# EAGLE design laserControlerArduinoShield (EAGLE 9.6.2)
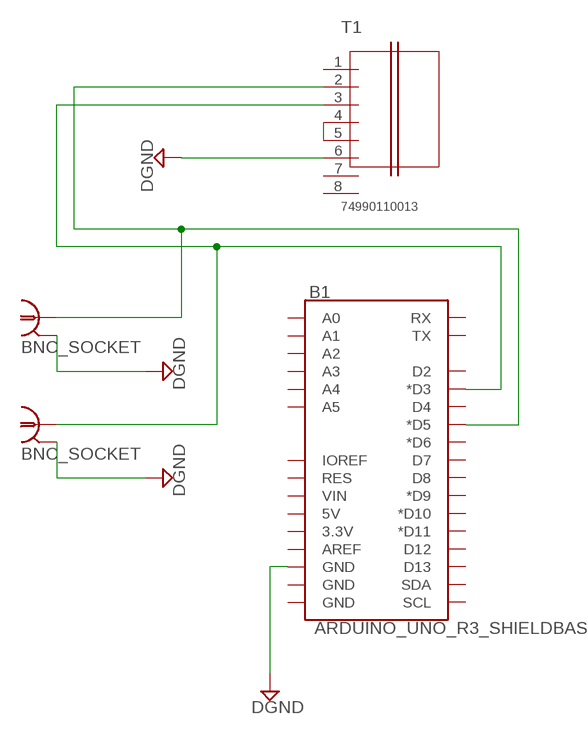
[diagram p0: schematic, sheet 1]

## Parts
B1  ARDUINO_UNO_R3_SHIELDBASIC  [UNO_R3_SHIELD]
BNC_POWER  BNC_SOCKET  [BNC_SOCKET]
BNC_TTL  BNC_SOCKET  [BNC_SOCKET]
T1  74990110013  [01LAN_RJ45_10/00_STD]

## Nets
DGND: B1.GND@2(GND) BNC_POWER.P$1 BNC_POWER.P$2 BNC_POWER.P$3 BNC_POWER.P$4 BNC_TTL.P$1 BNC_TTL.P$2 BNC_TTL.P$3 BNC_TTL.P$4 T1.6
N$1: B1.D5(*D5) BNC_TTL.P$SIGNAL T1.2
N$2: B1.D3(*D3) BNC_POWER.P$SIGNAL T1.3
N$3: T1.4 T1.5
Unconnected: B1.3.3V B1.5V B1.A0 B1.A1 B1.A2 B1.A3 B1.A4 B1.A5 B1.AREF B1.D2 B1.D4 B1.D6(*D6) B1.D7 B1.D8 B1.D9(*D9) B1.D10(*D10) B1.D11(*D11) B1.D12 B1.D13 B1.GND@0(GND) B1.GND@1(GND) B1.IOREF B1.RES B1.RX B1.SCL B1.SDA B1.TX B1.VIN T1.1 T1.7 T1.8

## Library data of the parts
B1 = SparkFun-Boards:ARDUINO_UNO_R3_SHIELD: Arduino R3 Shield Footprint Shield form compatible with the Arduino Uno R3. SparkFun Products: MG2639 Cellular Shield <https://www.sparkfun.com/products/13120> MIDI Shield <https://www.sparkfun.com/products/12898> R3 Stackable Headers Kit <https://www.sparkfun.com/products/11417>
BNC_POWER BNC_TTL = My_library:BNC_SOCKET: BNC socket RS 782-5590
T1 = wurth_electronics_midcom_inc_v1-0:74990110013: Package Style: HPLE RJ45 10/100 STD Mounting: THT LED: None Shield: 293-0533 Header: 183-0132 Windings Primary: Aux: Secondary: Best pinouts for production vary per application. Please contact Wurth Electronics Midcom, Inc. for assistance with your custom design. Datasheet: 74990110013 <http://katalog.we-online.de/kataloge/eisos/media/pdf/74990110013.pdf> Website: Wurth Electronics Midcom <http://www.we-online.com/midcom> Contact us Wurth Electronics Midcom, Inc. 121 Airport Dr. Watertown, SD 57201 Phone: (605) 886-4385 Fax: (605) 886-4486 E-Mail: midcom@we-online.com

## Board
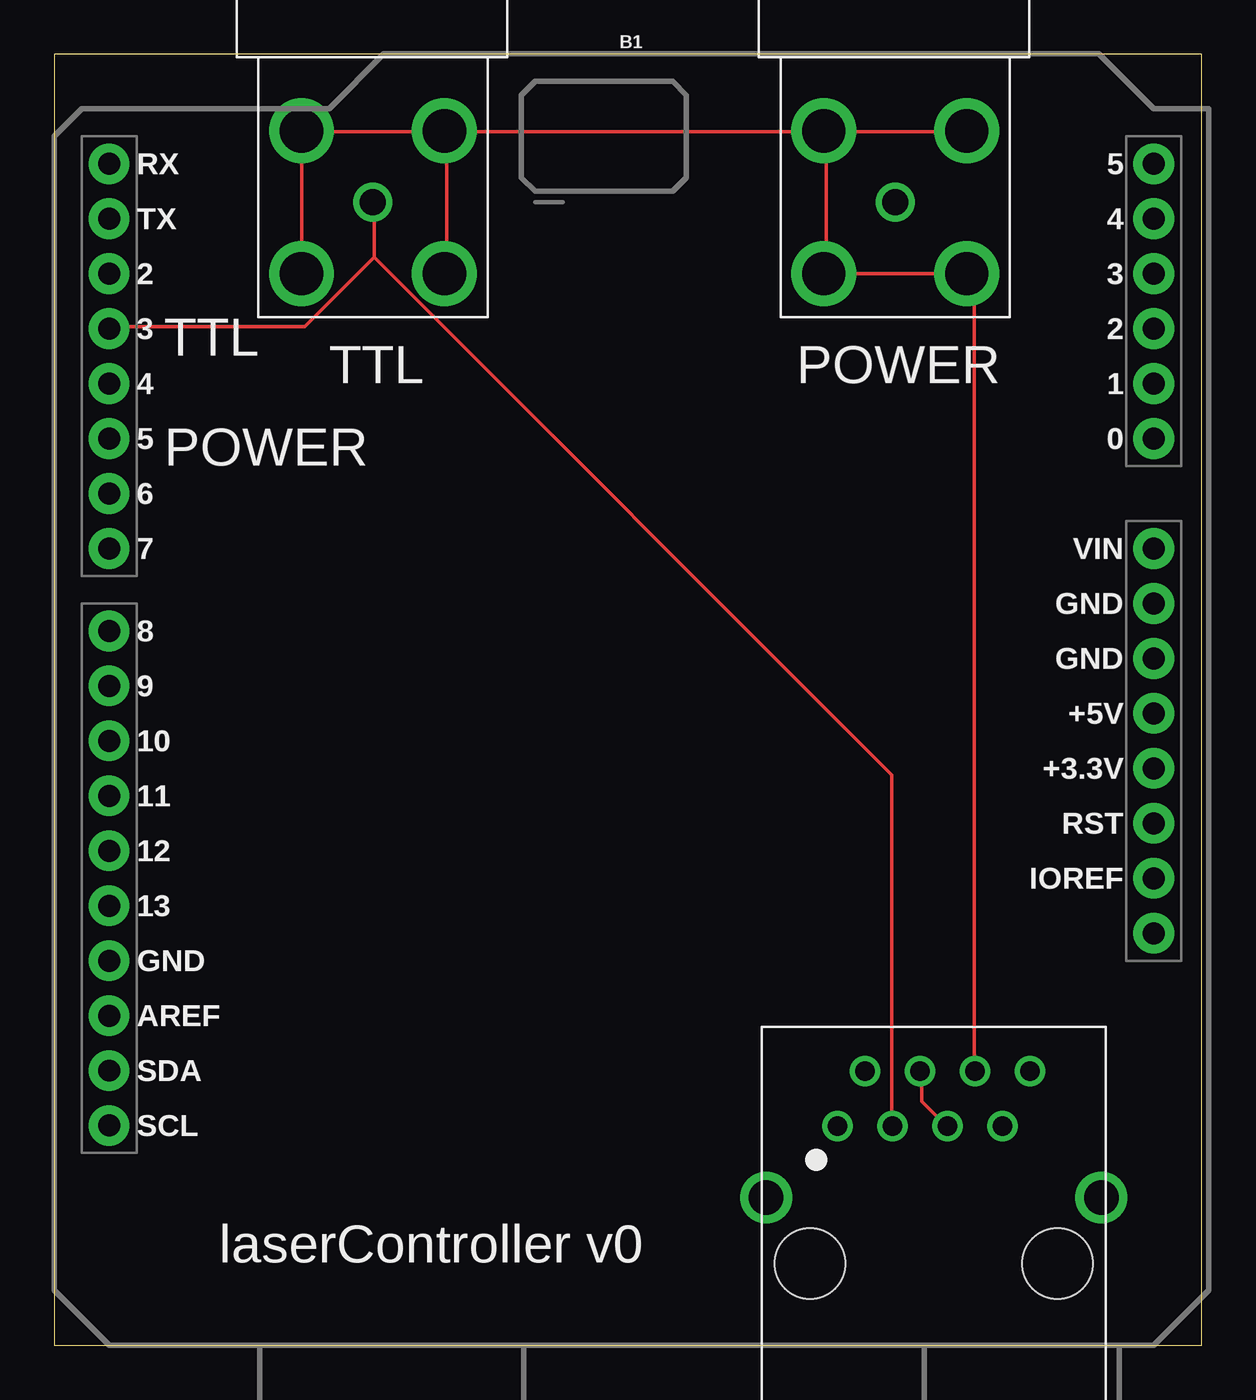
[diagram p1: board, top side]
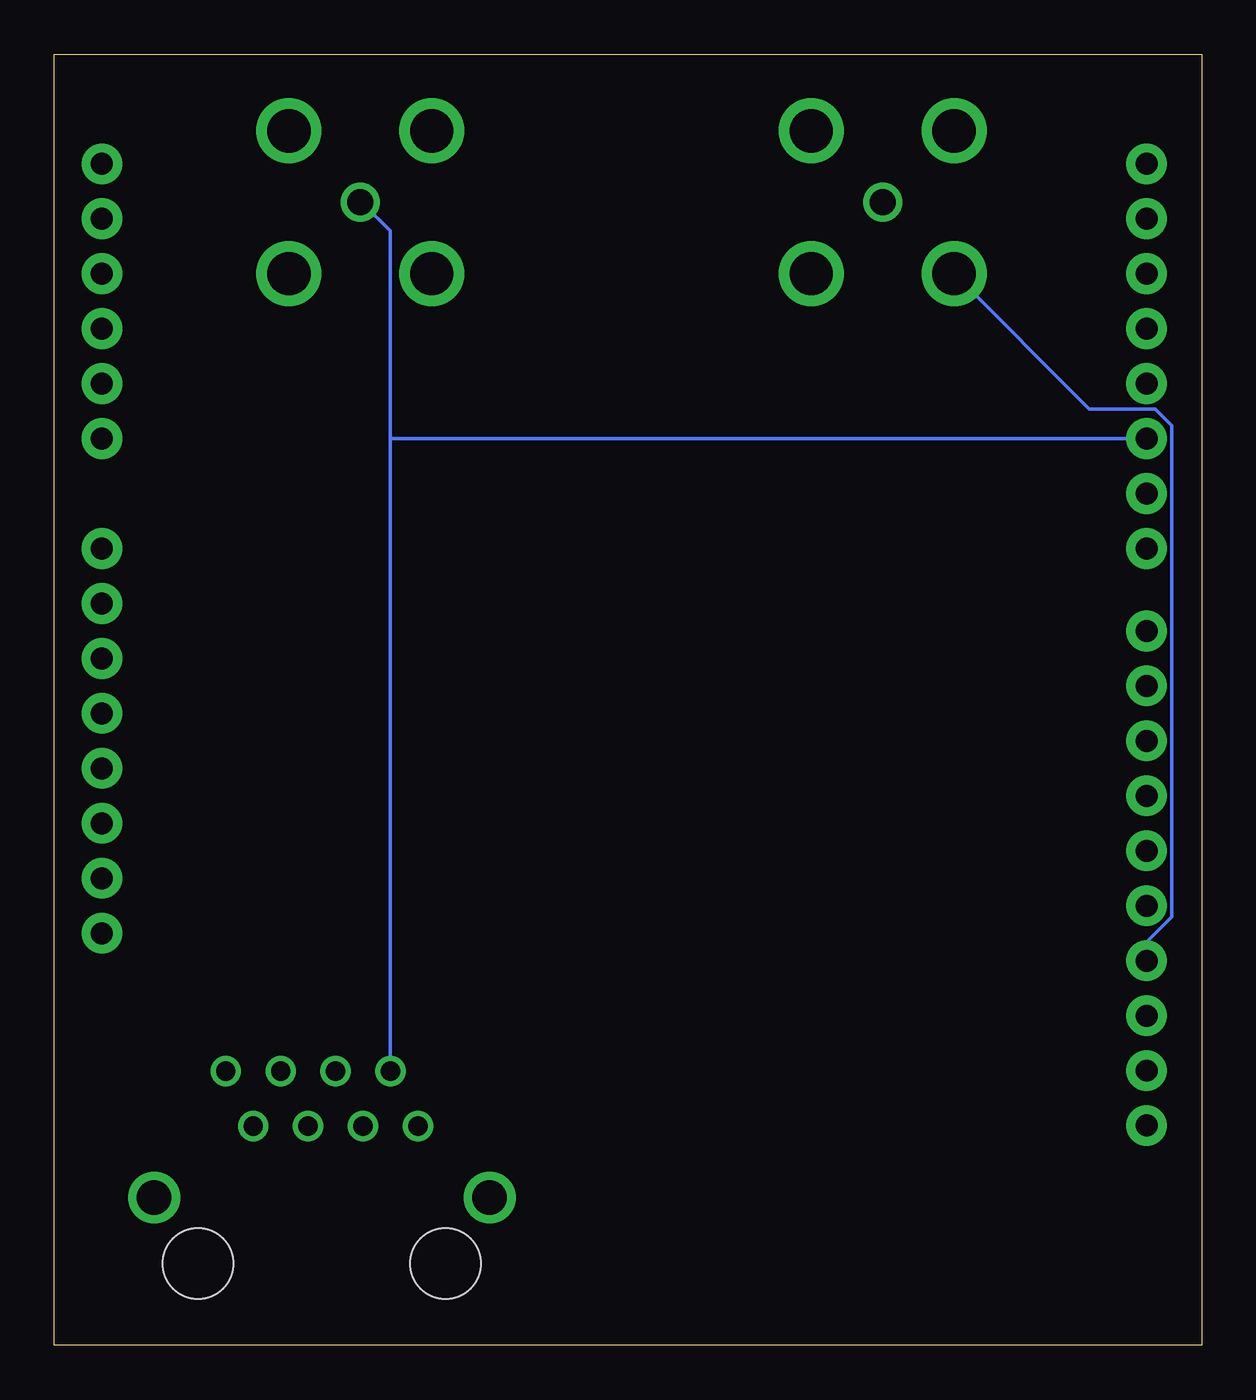
[diagram p2: board, bottom side, seen from below]

Size 53.01 x 59.68 mm. Coordinates in mm from the lower left corner, seen from the top.
Outline: 0,0 53.01,0 53.01,59.68 0,59.68 0,0
Copper layers (1*16): Top 0.035mm / dielectric 1.5mm / Bottom 0.035mm
Design rules "default": minimum track width 6mil, minimum drill 0.35mm, track to track 6mil, track to pad 6mil, pad to pad 6mil, via to via 6mil, smd to smd 6mil, copper to edge 40mil, drill to drill 6mil, minimum pad ring 10mil, minimum via ring 8mil, stop-mask expansion 4mil, vias tented up to drill 0mil, thermal gap 10mil

### Footprints (pad centres in the part's own frame; a part is rotated, then mirrored left to right if it is on the bottom)
UNO_R3_SHIELD = drill 1.016 pad 1.88: 3.3V 24.13,-2.54; 5V 24.13,0; A0 24.13,12.7; A1 24.13,15.24; A2 24.13,17.78; A3 24.13,20.32; A4 24.13,22.86; A5 24.13,25.4; AREF -24.13,-13.97; D2 -24.13,20.32; D3 -24.13,17.78; D4 -24.13,15.24; D5 -24.13,12.7; D6 -24.13,10.16; D7 -24.13,7.62; D8 -24.13,3.81; D9 -24.13,1.27; D10 -24.13,-1.27; D11 -24.13,-3.81; D12 -24.13,-6.35; D13 -24.13,-8.89; GND@0 24.13,2.54; GND@1 24.13,5.08; GND@2 -24.13,-11.43; IOREF 24.13,-7.62; NC 24.13,-10.16; RES 24.13,-5.08; RX -24.13,25.4; SCL -24.13,-19.05; SDA -24.13,-16.51; TX -24.13,22.86; VIN 24.13,7.62
BNC_SOCKET = drill 2: P$1 0,0; P$2 0,6.6; P$3 6.6,6.6; P$4 6.6,0 | drill 1.2: P$SIGNAL 3.3,3.3
01LAN_RJ45_10/00_STD = drill 0.889: 1 4.445,-6.325; 2 3.175,-8.865; 3 1.905,-6.325; 4 0.635,-8.865; 5 -0.635,-6.325; 6 -1.905,-8.865; 7 -3.175,-6.325; 8 -4.445,-8.865 | drill 1.6: 11 -7.747,-3.023; 12 7.747,-3.023 | hole 3.251: -5.715,0.025; 5.715,0.025

### Placement (x,y rotation side)
B1  26.67,29.21 0 top
BNC_POWER  11.43,49.53 0 top
BNC_TTL  35.56,49.53 0 top
T1  40.64,3.81 180 top

### Tracks (layer width: path | path; a pad name or v marks a point on that pad's centre or on a via)
DGND
  Top 0.152: 35.66,56.08 42.06,56.08 BNC_TTL.P$3 | T1.6 42.52,12.8 42.52,49.23 42.22,49.53 BNC_TTL.P$4 35.66,49.53 | 35.66,49.53 35.66,56.08 | 35.66,56.08 BNC_TTL.P$2 35.51,56.08 18.14,56.08 | 35.66,49.53 BNC_TTL.P$1 | 18.14,56.08 18.14,49.53 BNC_POWER.P$4 | 11.43,56.08 17.98,56.08 BNC_POWER.P$3 18.14,56.08 | BNC_POWER.P$1 11.43,56.08 | 11.43,56.08 BNC_POWER.P$2
  Bottom 0.152: BNC_POWER.P$1 5.18,43.28 2.13,43.28 1.37,42.52 1.37,19.81 2.44,18.75 2.44,17.83 B1.GND@2
N$1
  Bottom 0.152: 37.49,41.91 37.49,51.51 38.71,52.73 BNC_TTL.P$SIGNAL | 37.49,41.91 37.49,12.8 T1.2 | 37.49,41.91 B1.D5
N$2
  Top 0.152: 14.78,50.29 38.71,26.36 38.71,10.21 T1.3 | 14.78,50.29 14.78,52.73 BNC_POWER.P$SIGNAL | 14.78,50.29 11.58,47.09 2.59,47.09 B1.D3
N$3
  Top 0.152: T1.4 40.08,12.65 40.08,11.28 41.15,10.21 T1.5

### Text on the board
tNames: TTL | TTL | POWER | POWER | laserController v0